# Altium schematic sheet MOSFETs.SchDoc
size A4; SheetNumber: 7; SheetTotal: 7
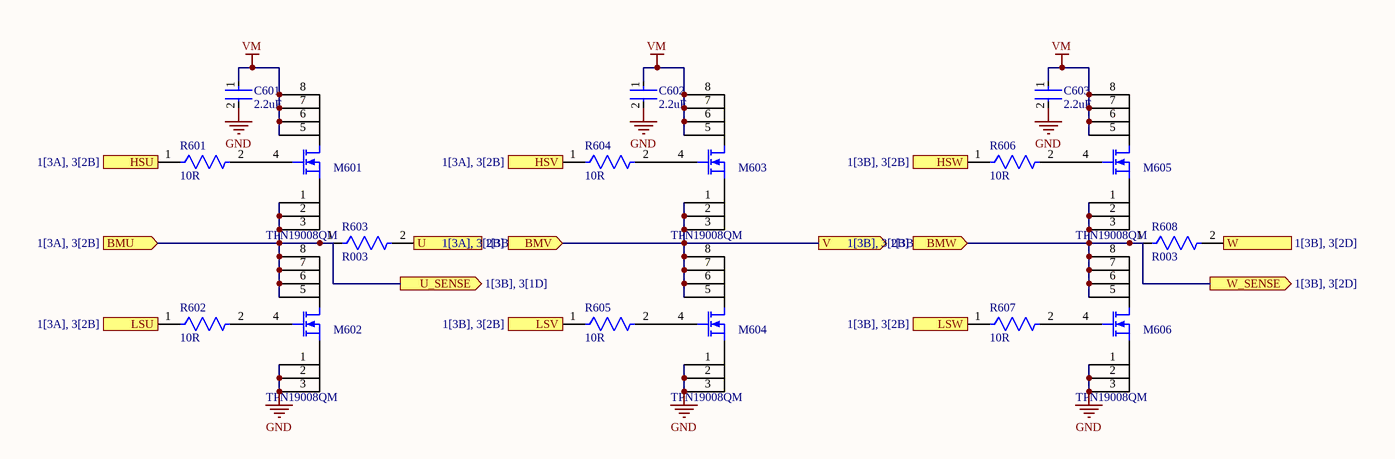
[diagram p0: MOSFETs.SchDoc]

## Parts
C601  2.2uF  [FP-CL32-IPC_B]
C602  2.2uF  [FP-CL32-IPC_B]
C603  2.2uF  [FP-CL32-IPC_B]
M601  TPN19008QM  [TSON Advance_TOS]
M602  TPN19008QM  [TSON Advance_TOS]
M603  TPN19008QM  [TSON Advance_TOS]
M604  TPN19008QM  [TSON Advance_TOS]
M605  TPN19008QM  [TSON Advance_TOS]
M606  TPN19008QM  [TSON Advance_TOS]
R601  10R  [FP-ERJ3EK-IPC_B]
R602  10R  [FP-ERJ3EK-IPC_B]
R603  R003  [FP-CRE2512-R001-R004-IPC_A]
R604  10R  [FP-ERJ3EK-IPC_B]
R605  10R  [FP-ERJ3EK-IPC_B]
R606  10R  [FP-ERJ3EK-IPC_B]
R607  10R  [FP-ERJ3EK-IPC_B]
R608  R003  [FP-CRE2512-R001-R004-IPC_A]

## Ports
BMU (in, see 1[3A], 3[2B]), BMV (in, see 1[3A], 3[2B]), BMW (in, see 1[3B], 3[2B]), HSU (in, see 1[3A], 3[2B]), HSV (in, see 1[3A], 3[2B]), HSW (in, see 1[3B], 3[2B]), LSU (in, see 1[3A], 3[2B]), LSV (in, see 1[3B], 3[2B]), LSW (in, see 1[3B], 3[2B]), U (out, see 1[3B], 3[1D]), U_SENSE (out, see 1[3B], 3[1D]), V (out, see 1[3B]), W (out, see 1[3B], 3[2D]), W_SENSE (out, see 1[3B], 3[2D])

## Nets
GND: C601.2 C602.2 C603.2 M602.1(SOURCE) M602.2(SOURCE) M602.3(SOURCE) M604.1(SOURCE) M604.2(SOURCE) M604.3(SOURCE) M606.1(SOURCE) M606.2(SOURCE) M606.3(SOURCE)
VM: C601.1 C602.1 C603.1 M601.5(DRAIN) M601.6(DRAIN) M601.7(DRAIN) M601.8(DRAIN) M603.5(DRAIN) M603.6(DRAIN) M603.7(DRAIN) M603.8(DRAIN) M605.5(DRAIN) M605.6(DRAIN) M605.7(DRAIN) M605.8(DRAIN)
BMU: M601.1(SOURCE) M601.2(SOURCE) M601.3(SOURCE) M602.5(DRAIN) M602.6(DRAIN) M602.7(DRAIN) M602.8(DRAIN) R603.1 ; port BMU, port U_SENSE
BMV: M603.1(SOURCE) M603.2(SOURCE) M603.3(SOURCE) M604.5(DRAIN) M604.6(DRAIN) M604.7(DRAIN) M604.8(DRAIN) ; port V, port BMV
BMW: M605.1(SOURCE) M605.2(SOURCE) M605.3(SOURCE) M606.5(DRAIN) M606.6(DRAIN) M606.7(DRAIN) M606.8(DRAIN) R608.1 ; port BMW, port W_SENSE
HSU: R601.1 ; port HSU
HSV: R604.1 ; port HSV
HSW: R606.1 ; port HSW
LSU: R602.1 ; port LSU
LSV: R605.1 ; port LSV
LSW: R607.1 ; port LSW
U: R603.2 ; port U
W: R608.2 ; port W
NetM601_4: M601.4(GATE) R601.2
NetM602_4: M602.4(GATE) R602.2
NetM603_4: M603.4(GATE) R604.2
NetM604_4: M604.4(GATE) R605.2
NetM605_4: M605.4(GATE) R606.2
NetM606_4: M606.4(GATE) R607.2

## Library data of the parts
C601-C603 = CMP-13271-002674-1: Cap Ceramic 2.2uF 100V X7R ±10% SMD 1210 +125°C Embossed T/R; Contact Plating: Tin; Tolerance: 10%; Case Code (Imperial): 1210; Height: 2.5mm; Case/Package: 1210; Mount: Surface Mount; Length: 3.2mm; Width: 0.098inch; Capacitance: 2.2uF; Voltage Rating: 100V; Max Operating Temperature: 125°C; Case Code (Metric): 3225; Packaging: Tape and Reel; Depth: 2.5mm; Voltage: 100V; Package Quantity: 1; Min Operating Temperature: -55°C; Radiation Hardening: No; Thickness: 0.106inch; Dielectric: X7R
M601-M606 = TPN19008QM: No Description Available; Mfr_Name: Toshiba Electronic Devices & Storage Corp.; RefDes: RefDes; Type: Type
R601 R602 R604-R607 = CMP-2000-00195-2: RES SMD 10 OHM 1% 1/10W 0603; Manufacturer Part Number: ERJ-3EKF10R0V; Manufacturer: Panasonic; Resistance: 10Ω; Voltage Rating: 75V; Value: 10Ω; Power: 100mW; Power Rating: 0.1W; Temperature Coefficient: 100ppm/°C; Automotive Grade: Grade 0; Lead Free: Yes; Device Class L1: Passive Components; Digikey Description: RES SMD 10 OHM 1% 1/10W 0603; Octopart: https://octopart.com/erj-3ekf10r0v-panasonic-55403649; Automotive: Yes; ComponentLink2URL: https://b2b-api.panasonic.eu/file_stream/pids/fileversion/1263; Height: 0.55mm; Temperature Range High: +155°C; Footprint Url: https://industrial.panasonic.com/cdbs/www-data/pdf/RDA0000/DMA0000COL17.pdf; Temperature: -55°C to +155°C; Tolerance: 1%; ComponentLink2Description: Datasheet; Package: ERJ3EK; Device Class L2: Resistors; Category: Res; Ipc Land Pattern Name: RESC16080X45; RoHS: TRUE; Composition: Thick Film; Device Class L3: Chip SMD Resistors; Temperature Range Low: -55°C; Series: ERJ
R603 R608 = CMP-07231-007668-1: RES 0.003 OHM 1% 3W 2512; Resistance: 3mR; Temperature Coefficient: 75ppm/°C; Mount: Surface Mount; Max Operating Temperature: 170°C; Min Operating Temperature: -55°C; Technology: METAL STRIP; Series: CRE2512; Case Code (Metric): 6432; Depth: 3.35mm; Case Code (Imperial): 2512; Width: 0.132inch; Case/Package: 2512; Packaging: Cut Tape; REACH SVHC: No SVHC; Resistance Tolerance: 1%; Termination: Solder; Tolerance: 1%; Features: Moisture Resistant; RoHS Compliant: No; Height: 0.035inch; Resistor Type: Metal Alloy; Power Rating: 3W; Number of Terminations: 2; Length: 0.254inch; Contact Plating: Tin; Max Power Dissipation: 3W